# EAGLE schematic lower (EAGLE 9.6.2)
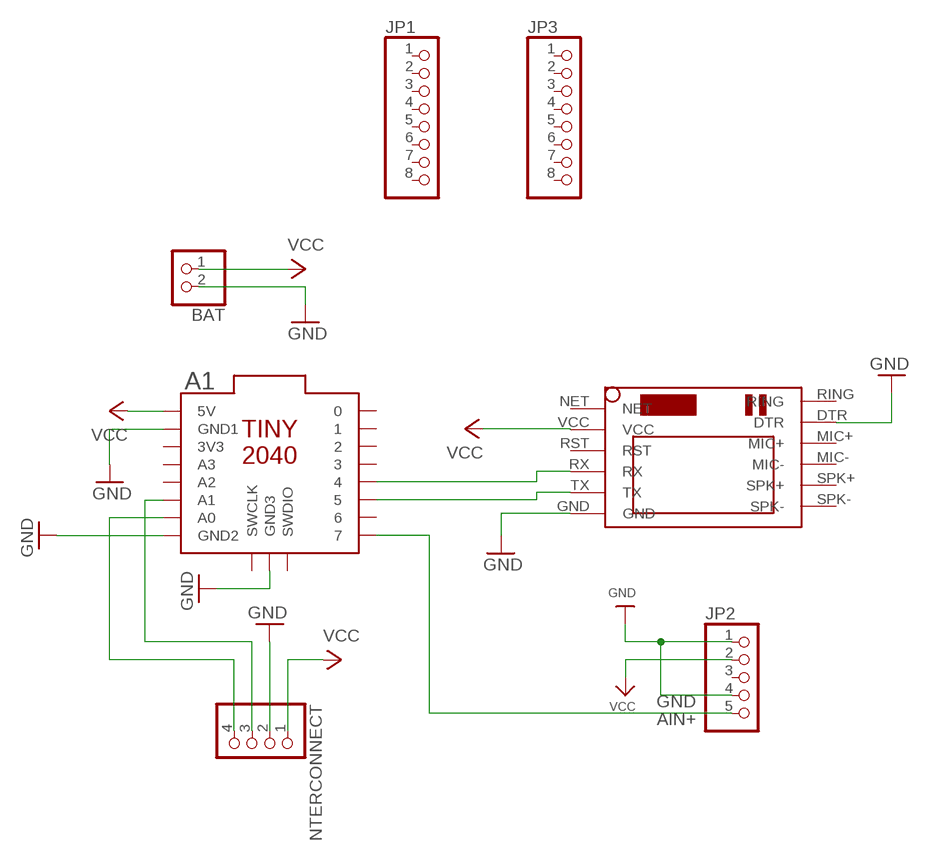
[diagram p0: schematic, sheet 1]

## Parts
A1  TINY2040  [TINY2040]
BAT  JST_2PIN-THM-RA  [JST-PH-2-THM-RA]
INTERCONNECT  PINHD-1X4  [1X04]
JP1  PINHD-1X8  [1X08]
JP2  HEADER-1X570MIL  [1X05_ROUND_70]
JP3  PINHD-1X8  [1X08]
U$2  SIM800LMODULE  [SIM800LMODULE]

## Nets
AIN+: A1.7 JP2.5
GND: A1.GND1 A1.GND2 A1.GND3 BAT.2 INTERCONNECT.2 JP2.1 JP2.4 U$2.DTR U$2.GND
N$1: A1.4 U$2.RX
N$2: A1.5 U$2.TX
N$3: A1.A1 INTERCONNECT.3
N$4: A1.A0 INTERCONNECT.4
VCC: A1.5V BAT.1 INTERCONNECT.1 JP2.2 U$2.VCC
Unconnected: A1.0 A1.1 A1.2 A1.3 A1.3V3 A1.6 A1.A2 A1.A3 A1.SWCLK A1.SWDIO JP1.1 JP1.2 JP1.3 JP1.4 JP1.5 JP1.6 JP1.7 JP1.8 JP2.3 JP3.1 JP3.2 JP3.3 JP3.4 JP3.5 JP3.6 JP3.7 JP3.8 U$2.MIC+ U$2.MIC- U$2.NET U$2.RING U$2.RST U$2.SPK+ U$2.SPK-

## Library data of the parts
A1 = pimoroni-boards:TINY2040
BAT = adafruit:JST_2PIN: JST 2-Pin Connectors of various flavors SMT-RA (S2B-PH-SM4) 4UConnector #17311 SMT (B2B-PH-SM4) THM-RA (S2B-PH) THM (B2B-PH)
INTERCONNECT = pinhead:PINHD-1X4: PIN HEADER
JP1 JP3 = pinhead:PINHD-1X8: PIN HEADER
JP2 = microbuilder:HEADER-1X5: PIN HEADER
U$2 = SIM800LMODULE:SIM800LMODULE: SIM800L Module